# EAGLE schematic Flight Computer R2 (EAGLE 6.4)
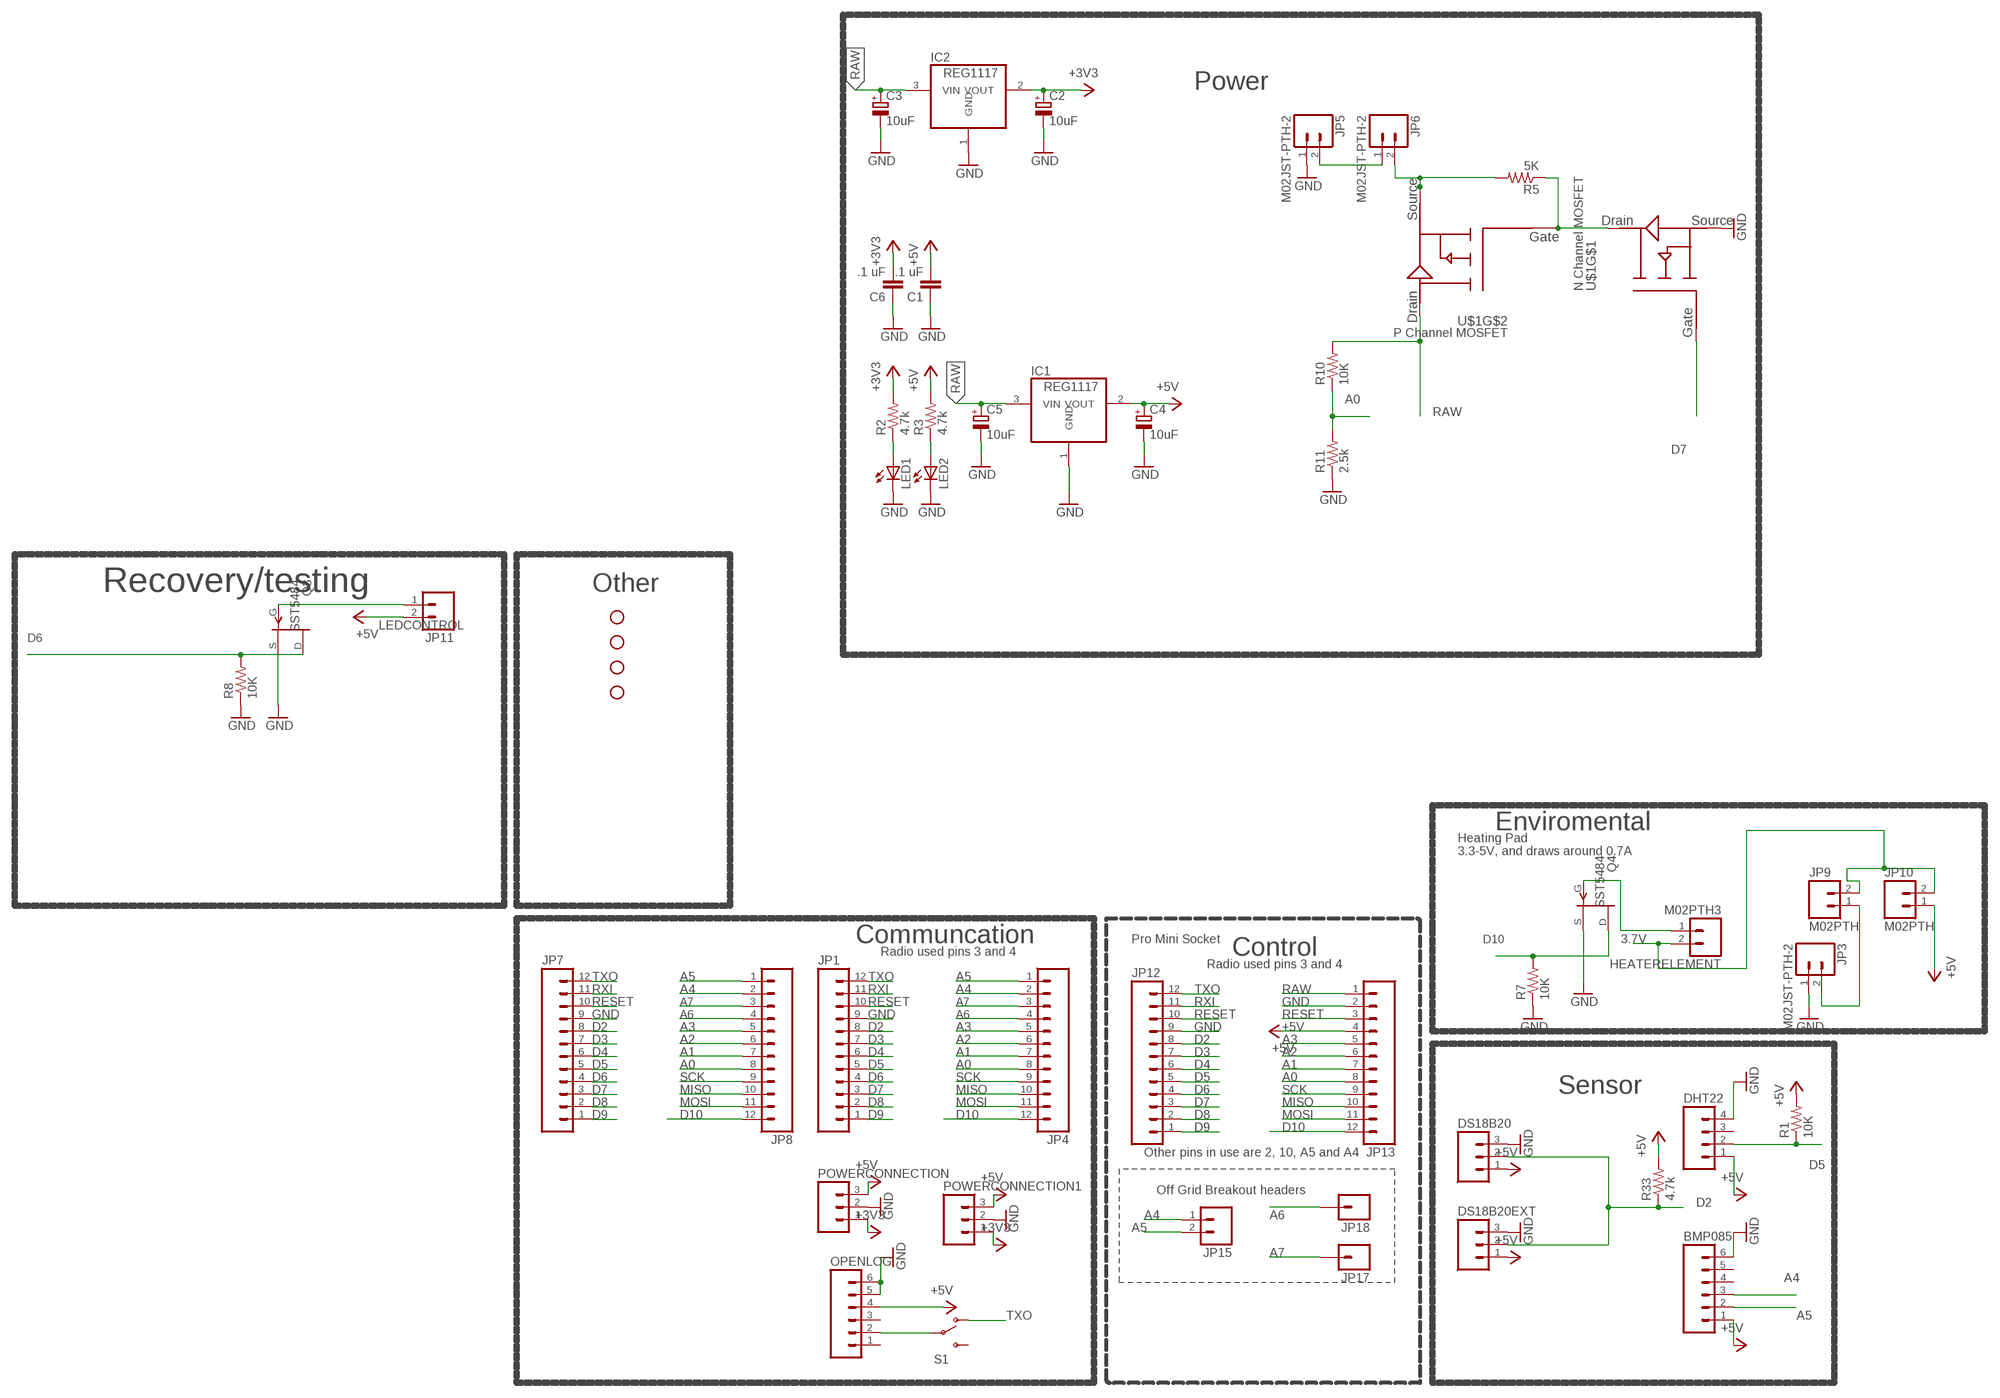
[diagram p0: schematic, sheet 1]

## Parts
BMP085  M06SIP  [1X06]
C1  .1 uF  CAP1206  [1206]
C2  10uF  CPOL-EUE2.5-5  [E2,5-5]
C3  10uF  CPOL-EUE2.5-5  [E2,5-5]
C4  10uF  CPOL-EUE2.5-5  [E2,5-5]
C5  10uF  CPOL-EUE2.5-5  [E2,5-5]
C6  .1 uF  CAP1206  [1206]
DHT22  M041X04_NO_SILK  [1X04_NO_SILK]
DS18B20  M03PTH  [1X03]
DS18B20EXT  M03PTH  [1X03]
HEATERELEMENT  M02PTH3  [1X02_LONGPADS]
IC1  REG1117  [SOT223]
IC2  REG1117  [SOT223]
JP1  M12PTH  [1X12]
JP3  M02JST-PTH-2  [JST-2-PTH]
JP4  M12PTH  [1X12]
JP5  M02JST-PTH-2  [JST-2-PTH]
JP6  M02JST-PTH-2  [JST-2-PTH]
JP7  M12PTH  [1X12]
JP8  M12PTH  [1X12]
JP9  M02PTH  [1X02]
JP10  M02PTH  [1X02]
JP11  M02PTH  [1X02]
JP12  M12PTH  [1X12]
JP13  M12PTH  [1X12]
JP15  M02PTH  [1X02]
JP17  M01PTH  [1X01]
JP18  M01PTH  [1X01]
LED1  LED3MM  [LED3MM]
LED2  LED3MM  [LED3MM]
OPENLOG  M06SIP  [1X06]
POWERCONNECTION  M03PTH  [1X03]
POWERCONNECTION1  M03PTH  [1X03]
Q3  SST5484  [SOT23]
Q4  SST5484  [SOT23]
R1  10K  RESISTOR1206  [1206]
R2  4.7k  RESISTOR1206  [1206]
R3  4.7k  RESISTOR1206  [1206]
R5  5K  RESISTOR1206  [1206]
R7  10K  RESISTOR1206  [1206]
R8  10K  RESISTOR1206  [1206]
R10  10K  RESISTOR1206  [1206]
R11  2.5k  RESISTOR1206  [1206]
R33  4.7k  RESISTOR1206  [1206]
S1  SWITCH-SPDTPTH  [SWITCH-SPDT]
STANDOFF1  STAND-OFF  [STAND-OFF]
STANDOFF2  STAND-OFF  [STAND-OFF]
STANDOFF3  STAND-OFF  [STAND-OFF]
STANDOFF4  STAND-OFF  [STAND-OFF]
U$1  IRF9389TRPBF  [SO-8]

## Nets
3.7V: HEATERELEMENT.2 JP9.2 JP10.2
3VOLT: LED1.A R2.1
5VOLT: LED2.A R3.1
+3V3: C2.+ C6.2 IC2.2(VOUT) POWERCONNECTION1.1 POWERCONNECTION.1 R2.2
+5V: BMP085.1 C1.2 C4.+ DHT22.1 DS18B20.1 DS18B20EXT.1 IC1.2(VOUT) JP10.1 JP11.2 JP13.4 OPENLOG.4 POWERCONNECTION1.3 POWERCONNECTION.3 R1.2 R3.2 R33.2
A0: JP4.8 JP8.8 JP13.8 R10.1 R11.2
A1: JP4.7 JP8.7 JP13.7
A2: JP4.6 JP8.6 JP13.6
A3: JP4.5 JP8.5 JP13.5
A4: BMP085.3 JP4.2 JP8.2 JP15.1
A5: BMP085.2 JP4.1 JP8.1 JP15.2
A6: JP4.4 JP8.4 JP18.1
A7: JP4.3 JP8.3 JP17.1
D2: DS18B20.2 DS18B20EXT.2 JP1.8 JP7.8 JP12.8 R33.1
D3: JP1.7 JP7.7 JP12.7
D4: JP1.6 JP7.6 JP12.6
D5: DHT22.2 JP1.5 JP7.5 JP12.5 R1.1
D6: JP1.4 JP7.4 JP12.4 Q3.1(D) R8.2
D7: JP1.3 JP7.3 JP12.3 U$1.2(GATE)
D8: JP1.2 JP7.2 JP12.2
D9: JP1.1 JP7.1 JP12.1
D10: JP4.12 JP8.12 JP13.12 Q4.1(D) R7.2
GND [vcc]: BMP085.6 C1.1 C2.- C3.- C4.- C5.- C6.1 DHT22.4 DS18B20.3 DS18B20EXT.3 IC1.1(GND) IC2.1(GND) JP1.9 JP3.1 JP5.1 JP7.9 JP12.9 JP13.2 LED1.K(C) LED2.K(C) OPENLOG.5 OPENLOG.6 POWERCONNECTION1.2 POWERCONNECTION.2 Q3.2(S) Q4.2(S) R7.1 R8.1 R11.1 U$1.1(SOURCE)
LEDCONTROL: JP11.1 Q3.3(G)
MISO: JP4.10 JP8.10 JP13.10
MOSI: JP4.11 JP8.11 JP13.11
N$1: HEATERELEMENT.1 Q4.3(G)
N$2: OPENLOG.2 S1.2(P)
N$9: JP6.2 R5.2 U$1.3(SOURCE)
N$10: JP5.2 JP6.1
N$29: R5.1 U$1.4(GATE) U$1.7(DRAIN)
N$31: JP3.2 JP9.1
RAW [vcc]: C3.+ C5.+ IC1.3(VIN) IC2.3(VIN) JP13.1 R10.2 U$1.5(DRAIN)
RESET: JP1.10 JP7.10 JP12.10 JP13.3
RXI: JP1.11 JP7.11 JP12.11
SCK: JP4.9 JP8.9 JP13.9
TXO: JP1.12 JP7.12 JP12.12 S1.1(O)
Unconnected: BMP085.4 BMP085.5 DHT22.3 OPENLOG.1 OPENLOG.3 S1.3(S)

## Notes on the sheet
- Power
- Recovery/testing | Other
- Enviromental
- Heating Pad
  3.3-5V, and draws around 0.7A
- Communcation | Pro Mini Socket
- Radio used pins 3 and 4 | Control
- Radio used pins 3 and 4
- Sensor
- Other pins in use are 2, 10, A5 and A4
- Off Grid Breakout headers

## Library data of the parts
BMP085 OPENLOG = SparkFun-Connectors:M06: Header 6 Standard 6-pin 0.1" header. Use with straight break away headers (SKU : PRT-00116), right angle break away headers (PRT-00553), swiss pins (PRT-00743), machine pins (PRT-00117), and female headers (PRT-00115). Molex polarized connector foot print use with SKU : PRT-08094 with associated crimp pins and housings. NOTES ON THE VARIANTS LOCK and LOCK_LONGPADS... This footprint was designed to help hold the alignment of a through-hole component (i.e. 6-pin header) while soldering it into place. You may notice that each hole has been shifted either up or down by 0.005 of an inch from it's more standard position (which is a perfectly straight line). This slight alteration caused the pins (the squares in the middle) to touch the edges of the holes. Because they are alternating, it causes a "brace" to hold the component in place. 0.005 has proven to be the perfect amount of "off-center" position when using our standard breakaway headers. Although looks a little odd when you look at the bare footprint, once you have a header in there, the alteration is very hard to notice. Also,if you push a header all the way into place, it is covered up entirely on the bottom side. This idea of altering the position of holes to aid alignment will be further integrated into the Sparkfun Library for other footprints. It can help hold any component with 3 or more connection pins.
C1 C6 = SparkFun-Passives:CAP: Capacitor Standard 0603 ceramic capacitor, and 0.1" leaded capacitor.
C2-C5 = rcl:CPOL-EU: POLARIZED CAPACITOR, European symbol
DHT22 = SparkFun-Connectors:M04: Header 4 Standard 4-pin 0.1" header. Use with straight break away headers (SKU : PRT-00116), right angle break away headers (PRT-00553), swiss pins (PRT-00743), machine pins (PRT-00117), and female headers (PRT-00115). Molex polarized connector foot print use with SKU : PRT-08231 with associated crimp pins and housings. 1MM SMD Version SKU: PRT-10208
DS18B20 DS18B20EXT POWERCONNECTION POWERCONNECTION1 = SparkFun-Connectors:M03: Header 3 Standard 3-pin 0.1" header. Use with straight break away headers (SKU : PRT-00116), right angle break away headers (PRT-00553), swiss pins (PRT-00743), machine pins (PRT-00117), and female headers (PRT-00115). Molex polarized connector foot print use with SKU : PRT-08232 with associated crimp pins and housings.
HEATERELEMENT JP3 JP5 JP6 JP9 JP10 = SparkFun-Connectors:M02: Standard 2-pin 0.1" header. Use with - straight break away headers ( PRT-00116) - right angle break away headers (PRT-00553) - swiss pins (PRT-00743) - machine pins (PRT-00117) - female headers (PRT-00115) Molex polarized connector foot print use with: PRT-08233 with associated crimp pins and housings. 2.54_SCREWTERM for use with PRT-10571. 3.5mm Screw Terminal footprints for PRT-08084 5mm Screw Terminal footprints for use with PRT-08433
IC1 IC2 = burr-brown:REG1117: 800mA and 1A Low Dropout (LDO) Positive Regulator 1.8V, 2.5V, 2.85V, 3.3V, 5V, and Adj; MPN: REG1117; OC_FARNELL: 1097566; OC_NEWARK: 14P6981
JP1 JP4 JP7 JP8 JP12 JP13 = SparkFun:M12: Header 12 Standard 12-pin 0.1" header. Use with straight break away headers (SKU : PRT-00116), right angle break away headers (PRT-00553), swiss pins (PRT-00743), machine pins (PRT-00117), and female headers (PRT-00115).
JP11 JP15 = SparkFun:M02: Header 2 Standard 2-pin 0.1" header. Use with straight break away headers (SKU : PRT-00116), right angle break away headers (PRT-00553), swiss pins (PRT-00743), machine pins (PRT-00117), and female headers (PRT-00115). Molex polarized connector foot print use with SKU : PRT-08233 with associated crimp pins and housings.
JP17 JP18 = SparkFun:M01: Header 1 Standard 1-pin 0.1" header. Use with straight break away headers (SKU : PRT-00116), right angle break away headers (PRT-00553), swiss pins (PRT-00743), machine pins (PRT-00117), and female headers (PRT-00115).
LED1 LED2 = SparkFun-LED:LED: LEDs Standard schematic elements and footprints for 5mm, 3mm, 1206, and 0603 sized LEDs. 5mm - Spark Fun Electronics SKU : COM-00529 (and others)
Q3 Q4 = transistor-fet:?548*: N-Channel JFETs Source: VISHAY 2N5484.pdf Compatible: TO92 2N5245 J304 J305 U310 J308 J309 J310 TO72 2N4416 2N4416A 2N3823 2N4351 3N169 3N170 3N171 MFE3002 TO18 2N3796 2N3797 MFE825 Source: Motorola European Master Guide Pacge 3-59
R1-R3 R5 R7 R8 R10 R11 R33 = SparkFun-Passives:RESISTOR: Resistor Basic schematic elements and footprints for 0603, 1206, and PTH resistors.
S1 = SparkFun-Electromechanical:SWITCH-SPDT: SPDT Switch Simple slide switch, Spark Fun Electronics SKU : COM-00102 DPDT SMT slide switch, AYZ0202, SWCH-08179
STANDOFF1-STANDOFF4 = SparkFun-Electromechanical:STAND-OFF: #4 Stand Off This is the mechanical footprint for a #4 phillips button head screw. Use the keepout ring to avoid running the screw head into surrounding components. SKU : PRT-00447
U$1 = ATEx Parts:IRF9389TRPBF

## Net classes
1 vcc: width 0.254 mm
3 30: width 0.762 mm